# Altium schematic sheet 105358-3SC001-02_BlockDiagram.SchDoc: Block Diagram
size 420 x 297 mm; DrawnBy: JeSa , KaKa; Organization: Hotswap Norden AB; Address1: Knarrarnäsgatan 7; Address2: SE-164 40 Kista; Address3: Sweden; DocumentNumber: 105358-3SC001-02; SheetNumber: 2; SheetTotal: 5; PageSetup: Record=PageOptions|CenterHorizontal=True|CenterVertical=True|PrintScale=0.96|XCorrection=1.00|YCorrection=1.00|PrintKind=0|BorderSize=5000000|LeftOffset=0|BottomOffset=0|Orientation=2|PaperLength=1000|PaperWidth=1000|Scale=100|PaperSource=7|PrintQuality=-4|MediaType=1|DitherType=10|PaperKind=A3|PrintScaleMode=1
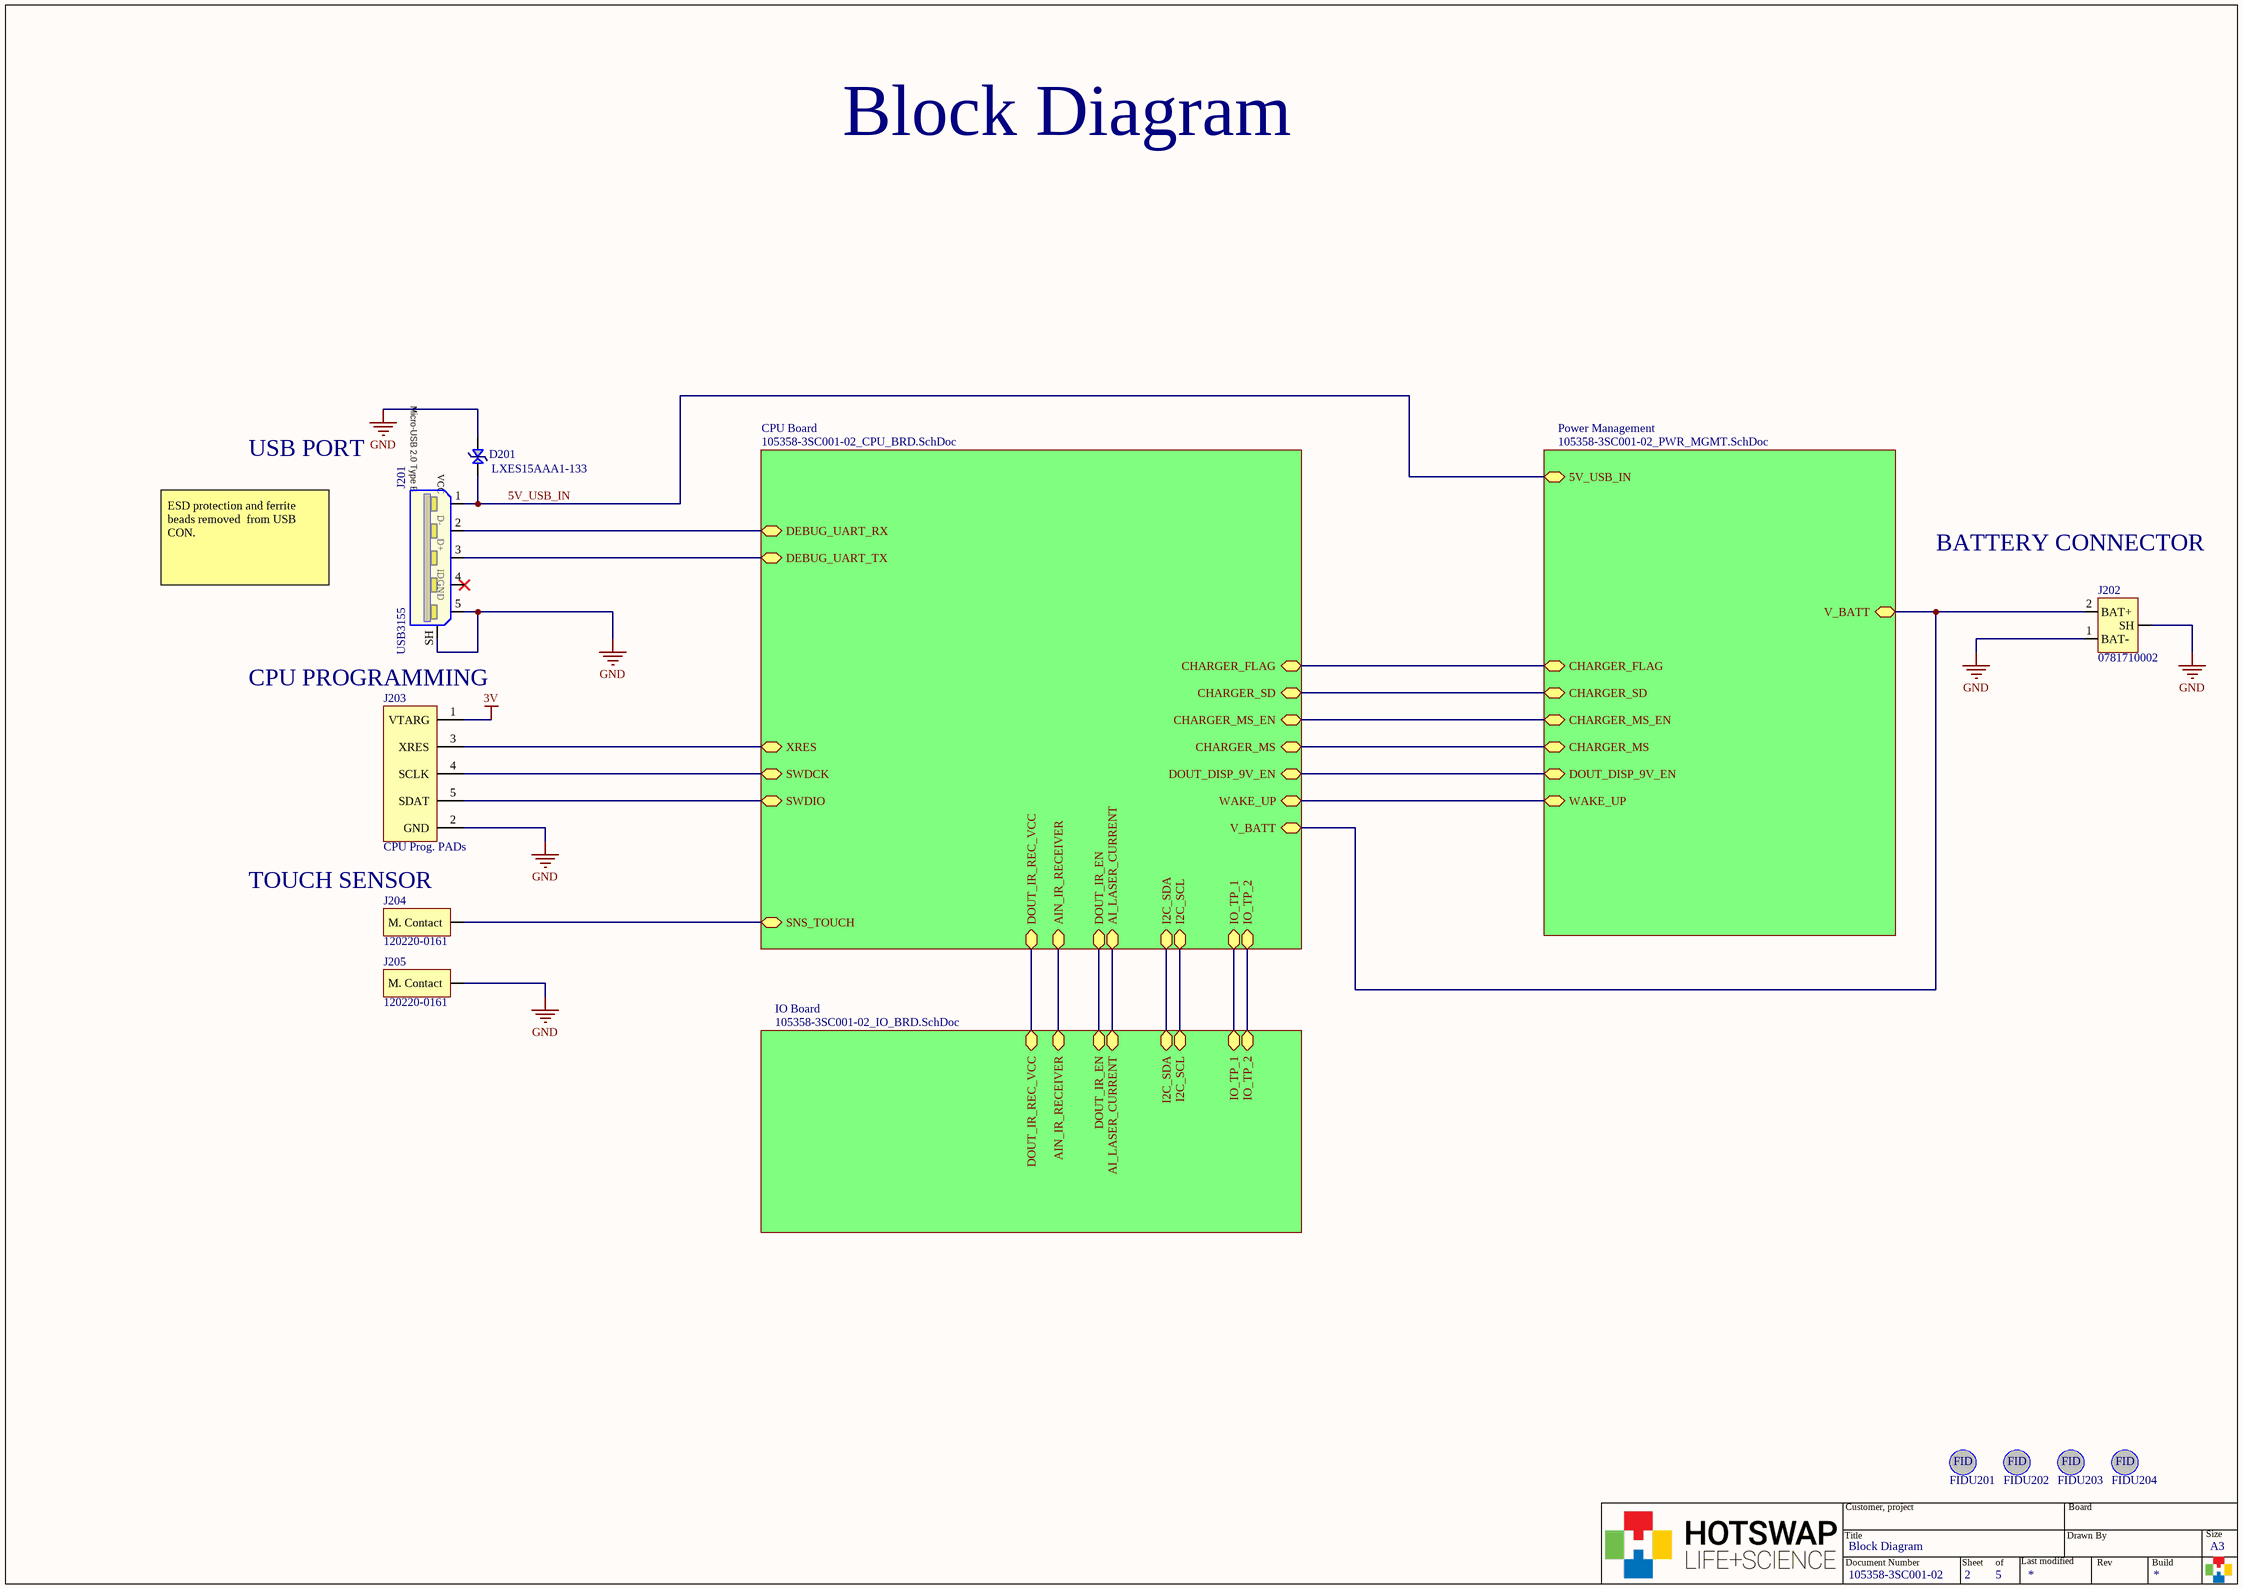
[diagram p0: 105358-3SC001-02_BlockDiagram.SchDoc]

## Parts
D201  LXES15AAA1-133  [0402C-GENERIC]
FIDU201  FIDU-miniROUND  [FIDU-MINI-ROUND]  (value not drawn)  (no BOM)
FIDU202  FIDU-miniROUND  [FIDU-MINI-ROUND]  (value not drawn)  (no BOM)
FIDU203  FIDU-miniROUND  [FIDU-MINI-ROUND]  (value not drawn)  (no BOM)
FIDU204  FIDU-miniROUND  [FIDU-MINI-ROUND]  (value not drawn)  (no BOM)
J201  USB3155  [USB3155]
J202  0781710002  [PAD 0781710002]
J203  CPU Prog. PADs  [PAD PROGRAMMING]  (no BOM)
J204  120220-0161  [PAD 1.0x3.76mm]
J205  120220-0161  [PAD 1.0x3.76mm]

## Sub-sheets
CPU Board = 105358-3SC001-02_CPU_BRD.SchDoc: DEBUG_UART_TX, CHARGER_FLAG, DEBUG_UART_RX, CHARGER_MS, CHARGER_SD, CHARGER_MS_EN, WAKE_UP, DOUT_DISP_9V_EN, XRES, SWDCK, SWDIO, AIN_IR_RECEIVER, I2C_SDA, I2C_SCL, IO_TP_1, IO_TP_2, SNS_TOUCH, AI_LASER_CURRENT, DOUT_IR_REC_VCC, DOUT_IR_EN, V_BATT
IO Board = 105358-3SC001-02_IO_BRD.SchDoc: AIN_IR_RECEIVER, I2C_SDA, I2C_SCL, IO_TP_1, IO_TP_2, AI_LASER_CURRENT, DOUT_IR_REC_VCC, DOUT_IR_EN
Power Management = 105358-3SC001-02_PWR_MGMT.SchDoc: CHARGER_FLAG, CHARGER_MS_EN, CHARGER_SD, CHARGER_MS, WAKE_UP, DOUT_DISP_9V_EN, 5V_USB_IN, V_BATT

## Nets
3V: J203.1(VTARG)
GND: D201.1 J201.5(GND) J201.SH(Shell) J202.1(BAT-) J202.3(SH) J203.2(GND) J205.1(M._Contact)
5V_USB_IN: D201.2 J201.1(VCC) ; sheet Power Management/5V_USB_IN
NetJ201_2: J201.2(D-) ; sheet CPU Board/DEBUG_UART_RX
NetJ201_3: J201.3(D+) ; sheet CPU Board/DEBUG_UART_TX
NetJ202_2: J202.2(BAT+) ; sheet Power Management/V_BATT, sheet CPU Board/V_BATT
NetJ203_3: J203.3(XRES) ; sheet CPU Board/XRES
NetJ203_4: J203.4(SCLK) ; sheet CPU Board/SWDCK
NetJ203_5: J203.5(SDAT) ; sheet CPU Board/SWDIO
NetJ204_1: J204.1(M._Contact) ; sheet CPU Board/SNS_TOUCH
(unnamed): sheet Power Management/CHARGER_FLAG, sheet CPU Board/CHARGER_FLAG
(unnamed): sheet Power Management/CHARGER_MS_EN, sheet CPU Board/CHARGER_MS_EN
(unnamed): sheet Power Management/CHARGER_SD, sheet CPU Board/CHARGER_SD
(unnamed): sheet Power Management/CHARGER_MS, sheet CPU Board/CHARGER_MS
(unnamed): sheet Power Management/WAKE_UP, sheet CPU Board/WAKE_UP
(unnamed): sheet Power Management/DOUT_DISP_9V_EN, sheet CPU Board/DOUT_DISP_9V_EN
(unnamed): sheet CPU Board/AIN_IR_RECEIVER, sheet IO Board/AIN_IR_RECEIVER
(unnamed): sheet CPU Board/I2C_SDA, sheet IO Board/I2C_SDA
(unnamed): sheet CPU Board/I2C_SCL, sheet IO Board/I2C_SCL
(unnamed): sheet CPU Board/IO_TP_1, sheet IO Board/IO_TP_1
(unnamed): sheet CPU Board/IO_TP_2, sheet IO Board/IO_TP_2
(unnamed): sheet CPU Board/AI_LASER_CURRENT, sheet IO Board/AI_LASER_CURRENT
(unnamed): sheet CPU Board/DOUT_IR_REC_VCC, sheet IO Board/DOUT_IR_REC_VCC
(unnamed): sheet CPU Board/DOUT_IR_EN, sheet IO Board/DOUT_IR_EN

Not connected (* = marked no-connect by the designer): J201 4(ID)*

## Notes on the sheet
- Block Diagram
- USB PORT
- ESD protection and ferrite beads removed  from USB CON.
- BATTERY CONNECTOR
- CPU PROGRAMMING
- TOUCH SENSOR
- Title
- Customer, project
- Drawn By
- Board
- Size
- Document Number
- Sheet
- of
- Last modified
- Rev
- Build
- A3
- (in symbol FIDU-miniROUND) FID
- (in symbol USB3155) Micro-USB 2.0 Type B

## Library data of the parts
D201 = TVS DIODE 15VWM 0402: Manufacturer: Murata Electronics North America; Type: Zener; Capacitance @ Frequency: 0.05pF @ 1MHz; Voltage - Reverse Standoff (Typ): 15V; Manufacturer Part Number: LXES15AAA1-133; Digi-Key Part Number: 490-13209-1-ND; PackageReference: 0402
J201 = USB3155: CONN RCPT USB-mini B 2.0 5POS SLD; Manufacturer: GCT (GLOBAL CONNECTOR TECHNOLOGY); Manufacturer Part Number: USB3155-30-A; Connector Type: USB - micro B; ComponentLink1Description: Datasheet; ComponentLink1URL: https://gct.co/files/drawings/usb3155.pdf; Digi-Key Part Number: 2537026-Farnell; ClassName: 3D_EXPORT; ComponentLink2Description: Product Specification; ComponentLink2URL: https://gct.co/files/specs/usb3155-spec.pdf
J202 = CONNECTOR 1.20MM WTB HEADER VERT 2POS: 1.20MM WTB HEADER VERT 2POS; Manufacturer: Molex, LLC; ComponentLink1URL: http://www.molex.com/pdm_docs/sd/781710002_sd.pdf; ComponentLink1Description: Datasheet; Manufacturer Part Number: 0781710002; Mounting Type: Surface Mount; Digi-Key Part Number: WM4459CT-ND; ClassName: 3D_EXPORT
J203 = PROGRAMMING PADS: CPU Programming PADs; ClassName: TP
J204 J205 = UNIVERSAL_CONTACT_2.5MM SMD: UNIVERSAL CONTACT 2.5MM SMD; Manufacturer: ITT Cannon, LLC; ComponentLink1URL: https://media.digikey.com/pdf/Data%20Sheets/ITT%20PDFs/Universal_Contact%202.5mm.pdf; ComponentLink1Description: Datasheet; Manufacturer Part Number: 120220-0161; Mounting Type: Surface Mount; Digi-Key Part Number: 1003-1009-1-ND; ClassName: 3D_EXPORT
FIDU201-FIDU204 = FIDU-miniROUND: ClassName: FIDU